# EasyEDA Pro project ProPrj_Zephyr_2026-01-05.epro, schematic Schematic1_3
Board Name: Board1; Create Date: 2025-12-29; Page Name: P1; Project Name: Zephyr; Schematic Name: Schematic1; Update Date: 2025-12-29; Company: EasyEDA.com; Page Size: A4; Version: V1.0
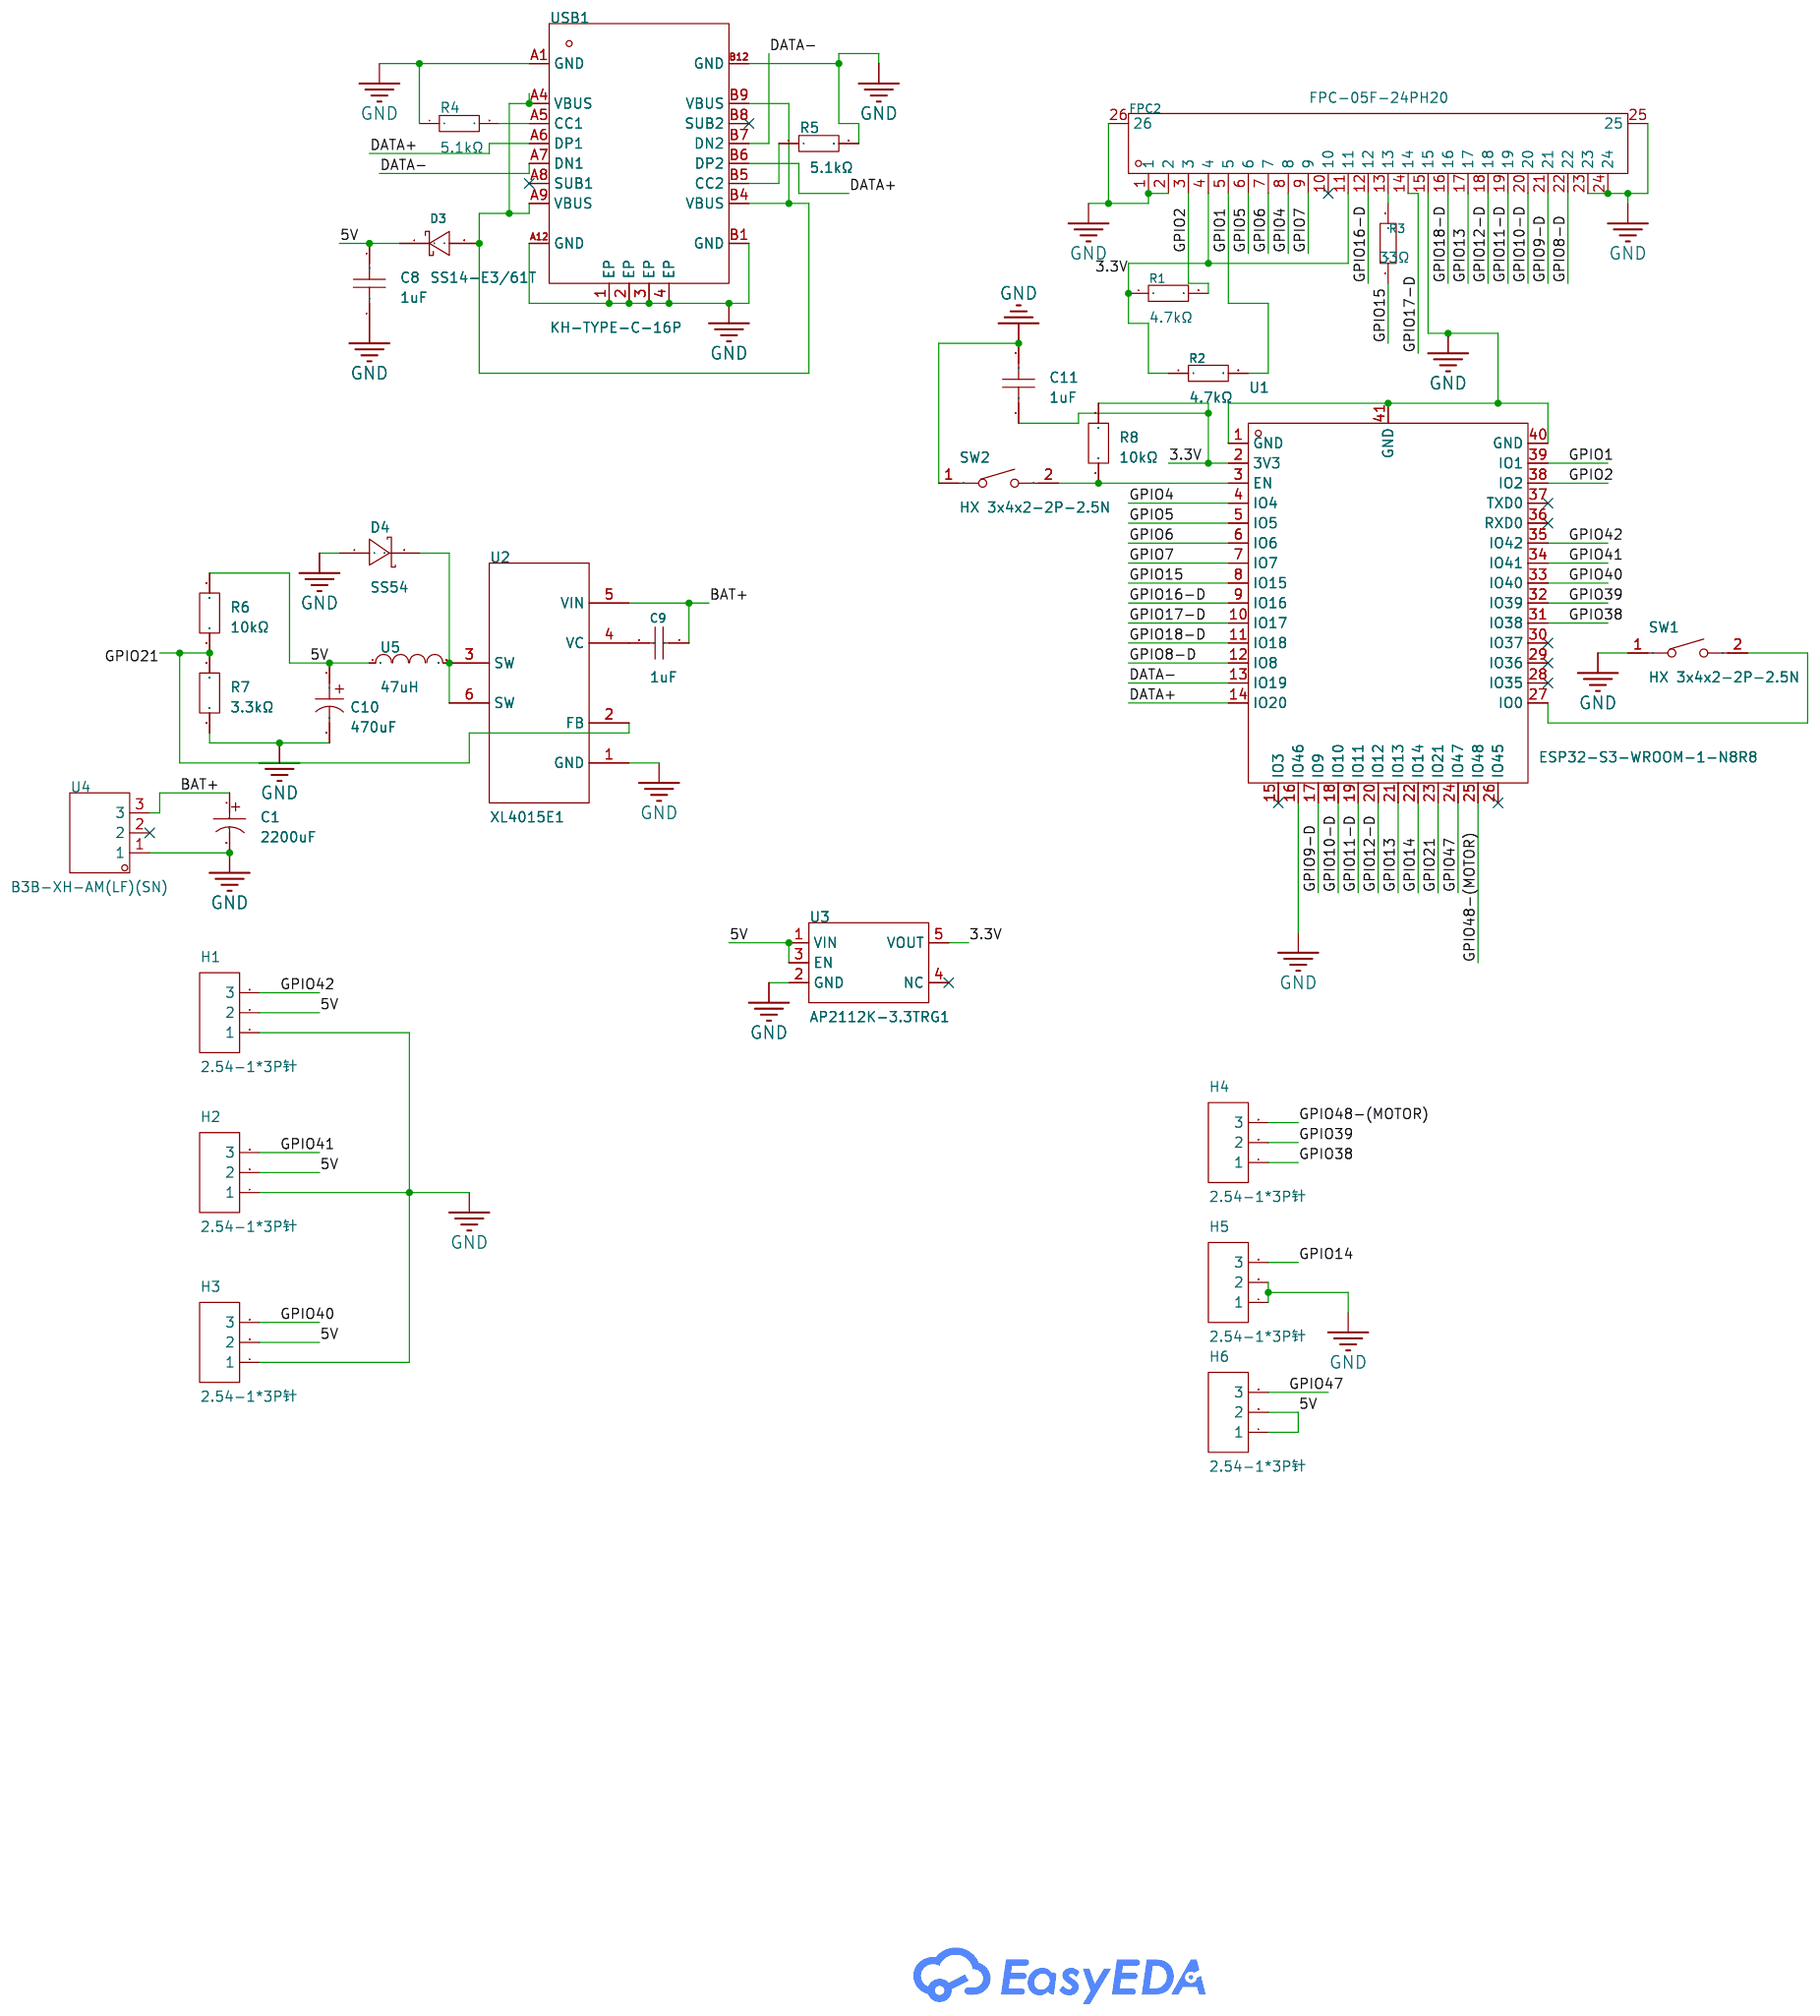
[diagram p2: schematic sheet]

## Parts
C1  2200uF  [CAP-TH_BD13.0-P5.00-D1.2-FD]
C8  1uF  [C1206]
C9  1uF  [C0805]
C10  470uF  [CAP-SMD_BD6.3-L6.6-W6.6-LS7.6-RD]
C11  1uF  [C1206]
D3  SS14-E3/61T  [SMA_L4.3-W2.6-LS5.2-RD]
D4  SS54  [SMA_L4.4-W2.8-LS5.4-R-RD]
FPC2  FPC-05F-24PH20  [FPC-SMD_24P-P0.50_FPC-05F-24PH20]
H1  2.54-1*3P针  [HDR-TH_3P-P2.54-V-M-1]
H2  2.54-1*3P针  [HDR-TH_3P-P2.54-V-M-1]
H3  2.54-1*3P针  [HDR-TH_3P-P2.54-V-M-1]
H4  2.54-1*3P针  [HDR-TH_3P-P2.54-V-M-1]
H5  2.54-1*3P针  [HDR-TH_3P-P2.54-V-M-1]
H6  2.54-1*3P针  [HDR-TH_3P-P2.54-V-M-1]
R1  4.7kΩ  [R1206]
R2  4.7kΩ  [R1206]
R3  33Ω  [R1206]
R4  5.1kΩ  [R1206]
R5  5.1kΩ  [R1206]
R6  10kΩ  [R1206]
R7  3.3kΩ  [R1206]
R8  10kΩ  [R1206]
SW1  HX 3x4x2-2P-2.5N  [SW-SMD_L4.0-W2.9-LS5.0]
SW2  HX 3x4x2-2P-2.5N  [SW-SMD_L4.0-W2.9-LS5.0]
U1  ESP32-S3-WROOM-1-N8R8  [WIRELM-SMD_ESP32-S3-WROOM-1]
U2  XL4015E1  [TO-263-5_L10.2-W8.9-P1.70-TL]
U3  AP2112K-3.3TRG1  [SOT-23-5_L2.9-W1.6-P0.95-LS2.8-BR]
U4  B3B-XH-AM(LF)(SN)  [CONN-TH_3P-P2.50_B3B-XH-AM-LF-SN]
U5  47uH  [IND-SMD_L17.5-W17.2]
USB1  KH-TYPE-C-16P  [USB-C-SMD_KH-TYPE-C-16P]

## Library data of the parts
C1 = KM228M025J20RR0VH2FP0: Capacitance:2200uF Tolerance:±20% Tolerance:±20% Voltage Rating:25V Ripple Current:- Equivalent Series Resistance(ESR):- Pin Spacing:5mm Diameter:13mm Height - Seated (Max):20mm Lifetime:2000hrs@105℃; LCSC Part Name: 2200uF ±20% 25V; Supplier Part: C44598; Manufacturer: Chengx(承兴); Supplier Footprint: 插件,D13xL20mm; JLCPCB Part Class: Extended Part; Datasheet: https://item.szlcsc.com/datasheet/KM228M025J20RR0VH2FP0/45600.html; Supplier: LCSC; Tolerance: ±20%; Voltage Rating: 25V; Pin Spacing: 5mm; Diameter: 13mm; Height - Seated (Max): 20mm; Lifetime: 2000hrs@105℃
C8 C11 = CL31B105KBHNNNE: Capacitance:1uF Tolerance:±10% Tolerance:±10% Voltage Rating:50V Temperature Coefficient:X7R; LCSC Part Name: 1uF ±10% 50V; Supplier Part: C1848; Manufacturer: SAMSUNG(三星); Supplier Footprint: 1206; JLCPCB Part Class: Basic Part; Datasheet: https://item.szlcsc.com/datasheet/CL31B105KBHNNNE/2200.html; Supplier: LCSC; Tolerance: ±10%; Voltage Rating: 50V; Temperature Coefficient: X7R
C9 = CL21B105KBFNNNE: Capacitance:1uF Tolerance:±10% Tolerance:±10% Voltage Rating:50V Temperature Coefficient:X7R; LCSC Part Name: 1uF ±10% 50V; Supplier Part: C28323; Manufacturer: SAMSUNG(三星); Supplier Footprint: 0805; JLCPCB Part Class: Basic Part; Datasheet: https://item.szlcsc.com/datasheet/CL21B105KBFNNNE/29074.html; Supplier: LCSC; Tolerance: ±10%; Voltage Rating: 50V; Temperature Coefficient: X7R
C10 = RVT1C471M0607: Capacitance:470uF Tolerance:±20% Tolerance:±20% Voltage Rating:16V Ripple Current:185mA@120Hz Diameter:6.3mm Height - Seated (Max):7.7mm Lifetime:2000hrs@105℃ Operating Temperature:-40℃~+105℃ Operating Temperature:-40℃~+105℃; LCSC Part Name: 470uF ±20% 16V; Supplier Part: C2977552; Manufacturer: ROQANG(容强); Supplier Footprint: SMD,D6.3xL7.7mm; JLCPCB Part Class: Extended Part; Supplier: LCSC; Tolerance: ±20%; Voltage Rating: 16V; Ripple Current: 185mA@120Hz; Diameter: 6.3mm; Height - Seated (Max): 7.7mm; Lifetime: 2000hrs@105℃; Operating Temperature: -40℃~+105℃
D3 = SS14-E3/61T: Diode Configuration:1 Independent Voltage - Forward(Vf@If):500mV@1A Voltage - DC Reverse(Vr):40V Current - Rectified:1A Reverse Leakage Current (Ir):200uA@40V Operating Junction Temperature Range:-65℃~+150℃ Operating Junction Temperature Range:-65℃~+150℃; LCSC Part Name: 电压:40V 电流:1A; Supplier Part: C47460; Manufacturer: VISHAY(威世); Supplier Footprint: SMA(DO-214AC); JLCPCB Part Class: Extended Part; Datasheet: https://item.szlcsc.com/datasheet/SS14-E3%252F61T/48465.html; Supplier: LCSC; Diode Configuration: 1 Independent; Voltage - Forward(Vf@If): 500mV@1A; Voltage - DC Reverse(Vr): 40V; Current - Rectified: 1A; Reverse Leakage Current (Ir): 200uA@40V; Operating Junction Temperature Range: -65℃~+150℃; Non-Repetitive Peak Forward Surge Current: 40A
D4 = SS54_C22452: Diode Configuration:Independent Voltage - Forward(Vf@If):550mV@5A Voltage - DC Reverse(Vr):40V Current - Rectified:5A Reverse Leakage Current (Ir):1mA@40V Operating Junction Temperature Range:-55℃~+125℃ Operating Junction Temperature Range:-55℃~+125℃; LCSC Part Name: 电压:40V 电流:5A; Supplier Part: C22452; Manufacturer: MDD(辰达半导体); Supplier Footprint: SMA(DO-214AC); JLCPCB Part Class: Basic Part; Datasheet: https://item.szlcsc.com/datasheet/SS54/23178.html; Supplier: LCSC; Diode Configuration: Independent; Voltage - Forward(Vf@If): 550mV@5A; Voltage - DC Reverse(Vr): 40V; Current - Rectified: 5A; Reverse Leakage Current (Ir): 1mA@40V; Operating Junction Temperature Range: -55℃~+125℃
FPC2 = FPC-05F-24PH20: Locking Feature:Hinged Lid Contact Type:Surface Mount Number of Contacts:24P Pitch:0.5mm Mounting Type:Bottom Contact FFC, FCB Thickness:0.3mm FFC, FCB Thickness:0.3mm Height Above Board:2mm Contact Material:Phosphor Bronze Contact Plating:Tin Operating T; LCSC Part Name: 翻盖式 卧贴 P数:24P 间距:0.5mm; Supplier Part: C2856805; Manufacturer: XUNPU(讯普); Supplier Footprint: SMD,P=0.5mm,卧贴; JLCPCB Part Class: Extended Part; Datasheet: https://item.szlcsc.com/datasheet/FPC-05F-24PH20/3056903.html; Supplier: LCSC; Locking Feature: Hinged Lid; Contact Type: Surface Mount; Number of Contacts: 24P; Pitch: 0.5mm; Mounting Type: Bottom Contact; FFC, FCB Thickness: 0.3mm; Height Above Board: 2mm; Contact Material: Phosphor Bronze; Contact Plating: Tin; Operating Temperature: -25℃~+85℃; Rated Voltage (Max): 50V; Current Rating (Max): 500mA
H1-H6 = 2.54-1*3P针: Pin Structure:1x3P Pitch:2.54mm Row Spacing:- Circluar Pins/Square Pins:Pin Header Mounting Type:Through Hole Number of Rows:1 Number of Pins:3P Current Rating:3A Voltage Rating (Max):- Length of Mating Pin:6mm Insulation Height:2.5mm Length of End Connec; LCSC Part Name: 1x3P 间距:2.54mm 方针 直插; Supplier Part: C49257; Manufacturer: BOOMELE(博穆精密); Supplier Footprint: 插件,P=2.54mm; JLCPCB Part Class: Extended Part; Datasheet: https://item.szlcsc.com/datasheet/2.54-1*3P%25E9%2592%2588/50265.html; Supplier: LCSC; Pin Structure: 1x3P; Pitch: 2.54mm; Circluar Pins/Square Pins: Pin Header; Mounting Type: Through Hole; Number of Rows: 1; Number of Pins: 3P; Current Rating: 3A; Length of Mating Pin: 6mm; Insulation Height: 2.5mm; Length of End Connection Pin: 3mm; Contact Material: Brass; Contact Plating: Gold; Operating Temperature: -40℃~+105℃; Color: Black
R1 R2 = 1206W4F4701T5E: Type:Thick Film Resistor Resistance:4.7kΩ Tolerance:±1% Tolerance:±1% Power(Watts):250mW Voltage-Supply(Max):200V Temperature Coefficient:±100ppm/℃ Temperature Coefficient:±100ppm/℃ Operating Temperature:-55℃~+155℃ Operating Temperature:-55℃~+155℃; LCSC Part Name: 4.7kΩ ±1% 250mW 厚膜电阻; Supplier Part: C17936; Manufacturer: UNI-ROYAL(厚声); Supplier Footprint: 1206; JLCPCB Part Class: Basic Part; Datasheet: https://item.szlcsc.com/datasheet/1206W4F4701T5E/18624.html; Supplier: LCSC; Type: Thick Film Resistor; Tolerance: ±1%; Power(Watts): 250mW; Voltage-Supply(Max): 200V; Temperature Coefficient: ±100ppm/℃; Operating Temperature: -55℃~+155℃
R3 = 1206W4F330JT5E: Type:Thick Film Resistor Resistance:33Ω Tolerance:±1% Tolerance:±1% Power(Watts):250mW Voltage-Supply(Max):200V Temperature Coefficient:±200ppm/℃ Temperature Coefficient:±200ppm/℃ Operating Temperature:-55℃~+155℃ Operating Temperature:-55℃~+155℃; LCSC Part Name: 33Ω ±1% 250mW 厚膜电阻; Supplier Part: C18005; Manufacturer: UNI-ROYAL(厚声); Supplier Footprint: 1206; JLCPCB Part Class: Extended Part; Datasheet: https://item.szlcsc.com/datasheet/1206W4F330JT5E/18693.html; Supplier: LCSC; Type: Thick Film Resistor; Tolerance: ±1%; Power(Watts): 250mW; Voltage-Supply(Max): 200V; Temperature Coefficient: ±200ppm/℃; Operating Temperature: -55℃~+155℃
R4 R5 = RC1206FR-075K1L: Type:Thick Film Resistor Resistance:5.1kΩ Tolerance:±1% Tolerance:±1% Power(Watts):250mW Voltage-Supply(Max):200V Temperature Coefficient:±100ppm/℃ Temperature Coefficient:±100ppm/℃ Operating Temperature:-55℃~+155℃ Operating Temperature:-55℃~+155℃; LCSC Part Name: 厚膜电阻 5.1kΩ ±1% 250mW; Supplier Part: C163372; Manufacturer: YAGEO(国巨); Supplier Footprint: 1206; JLCPCB Part Class: Extended Part; Datasheet: https://item.szlcsc.com/datasheet/RC1206FR-075K1L/174753.html; Supplier: LCSC; Type: Thick Film Resistor; Tolerance: ±1%; Power(Watts): 250mW; Voltage-Supply(Max): 200V; Temperature Coefficient: ±100ppm/℃; Operating Temperature: -55℃~+155℃
R6 R8 = FRC1206J103 TS: Type:Thick Film Resistor Resistance:10kΩ Tolerance:±5% Tolerance:±5% Power(Watts):250mW Voltage-Supply(Max):200V Temperature Coefficient:±100ppm/℃ Temperature Coefficient:±100ppm/℃ Operating Temperature:-55℃~+155℃ Operating Temperature:-55℃~+155℃; LCSC Part Name: 10kΩ ±5% 250mW 厚膜电阻; Supplier Part: C2907423; Manufacturer: FOJAN(富捷); Supplier Footprint: 1206; JLCPCB Part Class: Extended Part; Supplier: LCSC; Type: Thick Film Resistor; Tolerance: ±5%; Power(Watts): 250mW; Voltage-Supply(Max): 200V; Temperature Coefficient: ±100ppm/℃; Operating Temperature: -55℃~+155℃
R7 = FRC1206J332 TS: Type:Thick Film Resistor Resistance:3.3kΩ Tolerance:±5% Tolerance:±5% Power(Watts):250mW Voltage-Supply(Max):200V Temperature Coefficient:±100ppm/℃ Temperature Coefficient:±100ppm/℃ Operating Temperature:-55℃~+155℃ Operating Temperature:-55℃~+155℃; LCSC Part Name: 3.3kΩ ±5% 250mW 厚膜电阻; Supplier Part: C2907469; Manufacturer: FOJAN(富捷); Supplier Footprint: 1206; JLCPCB Part Class: Extended Part; Supplier: LCSC; Type: Thick Film Resistor; Tolerance: ±5%; Power(Watts): 250mW; Voltage-Supply(Max): 200V; Temperature Coefficient: ±100ppm/℃; Operating Temperature: -55℃~+155℃
SW1 SW2 = HX 3x4x2-2P-2.5N: Circuit:SPST Actuator Style:Round Button Operating Force:2.5N Mounting Type:Surface Mount,Vertical Length:4mm Width:3mm Switch Height:2mm with Bracket:Without Bracket Contact Current:50mA Voltage Rating:12V Actuator/Cap Color:Black With Lamp:No IP Rating:; LCSC Part Name: 4*3*2mm 立贴 轻触开关; Supplier Part: C36498961; Manufacturer: hanxia(韩下); Supplier Footprint: SMD,3x4mm; JLCPCB Part Class: Extended Part; Datasheet: https://item.szlcsc.com/datasheet/HX%25203x4x2-2P-2.5N/38220903.html; Supplier: LCSC; Circuit: SPST; Actuator Style: Round Button; Operating Force: 2.5N; Mounting Type: Surface Mount,Vertical; Length: 4mm; Width: 3mm; Switch Height: 2mm; with Bracket: Without Bracket; Contact Current: 50mA; Voltage Rating: 12V; Actuator/Cap Color: Black; With Lamp: No; Termination Style: SMD(SMT) Tab; Life: 100,000 Cycles
U1 = ESP32-S3-WROOM-1-N8R8: Supplier Part: C2913201; Manufacturer: ESPRESSIF(乐鑫); Supplier Footprint: SMD,25.5x18mm; JLCPCB Part Class: Extended Part; Datasheet: https://item.szlcsc.com/datasheet/ESP32-S3-WROOM-1-N8R8/3198299.html; Supplier: LCSC
U2 = XL4015E1: Function:Buck Voltage - Supply:8V~36V Voltage - Supply:8V~36V Output Voltage:1.25V~32V Output Voltage:1.25V~32V Output Current:5A Frequency - Switching:180kHz Frequency - Switching:180kHz Operating Temperature:-40℃~+125℃ Operating Temperature:-40℃~+125℃ S; LCSC Part Name: 5A 180KHz 36V 降压型DC-DC转换器; Supplier Part: C51661; Manufacturer: XLSEMI(芯龙); Supplier Footprint: TO-263-5; JLCPCB Part Class: Extended Part; Datasheet: https://item.szlcsc.com/datasheet/XL4015E1/52674.html; Supplier: LCSC; Function: Buck; Voltage - Supply: 8V~36V; Output Voltage: 1.25V~32V; Output Current: 5A; Frequency - Switching: 180kHz; Operating Temperature: -40℃~+125℃; Synchronous Rectifier: No; Number of Outputs: 1; Topology: Buck; Quiescent Current: 5mA; Switch tube (built-in/external): Built-in; Output Type: Adjustable
U3 = AP2112K-3.3TRG1_C23380830: Output Type:Fixed Voltage - Supply:5.5V Output Voltage:3.3V Output Voltage:3.3V Output Current:600mA Power Supply Rejection Ratio (PSRR):75dB@(1kHz) Voltage Dropout:320mV@(600mA) standby current:10uA Features:Over Temperature Protection Operating Temperat; LCSC Part Name: 集成电路; Supplier Part: C23380830; Manufacturer: TECH PUBLIC(台舟); Supplier Footprint: SOT-23-5; JLCPCB Part Class: Extended Part; Datasheet: https://item.szlcsc.com/datasheet/AP2112K-3.3TRG1/25111500.html; Supplier: LCSC; Output Type: Fixed; Voltage - Supply: 5.5V; Output Voltage: 3.3V; Output Current: 600mA; Power Supply Rejection Ratio (PSRR): 75dB@(1kHz); Voltage Dropout: 320mV@(600mA); standby current: 10uA; Features: Over Temperature Protection; Operating Temperature: -40℃~+85℃@(Ta); Output Configuration: Positive; Number of Outputs: 1
U4 = B3B-XH-AM(LF)(SN): Pins Structure:1x3P Pitch:2.5mm Mounting Type:Through Hole Reference Series:XH Number of Pins:3P Number of Rows:1 Number of PINs Per Row:3 Row Spacing:- Current Rating:3A Contact Material:Brass Contact Plating:Tin Operating Temperature:-25℃~+85℃ Operating; LCSC Part Name: 1x3P 间距:2.5mm 直插 系列:XH; Supplier Part: C161870; Manufacturer: JST; Supplier Footprint: 插件,P=2.5mm; JLCPCB Part Class: Extended Part; Datasheet: https://item.szlcsc.com/datasheet/B3B-XH-AM(LF)(SN)/173251.html; Supplier: LCSC; Pins Structure: 1x3P; Pitch: 2.5mm; Mounting Type: Through Hole; Reference Series: XH; Number of Pins: 3P; Number of Rows: 1; Number of PINs Per Row: 3; Current Rating: 3A; Contact Material: Brass; Contact Plating: Tin; Operating Temperature: -25℃~+85℃; Voltage Rating: 250V; Plastic Material: PA66; Flame Retardant Rating: UL94V-0; Supplementary Features: with locating pin；K Pin; Color: White; Z-Height of the Board: 7mm; X-Length of Bottom Edge on Board (Spacing Line): 9.9mm; Y-Width of Bottom Edge on Board: 5.75mm
U5 = SMMS1770-470M: Inductance: Tolerance:±20% Tolerance:±20% Rated Current: Saturation Current (Isat):16A DC Resistance (DCR): Type:一体成型电感 Ratings:-; LCSC Part Name: 47uH ±20% 16A; Supplier Part: C2976971; Manufacturer: SXN(顺翔诺); Supplier Footprint: SMD,17.5x17.15x7mm; JLCPCB Part Class: Extended Part; Datasheet: https://atta.szlcsc.com/upload/public/pdf/source/20220224/D8C8E12B51A4AD75CA32F676574334C0.pdf; Supplier: LCSC; Tolerance: ±20%; Saturation Current (Isat): 16A; Type: 一体成型电感
USB1 = KH-TYPE-C-16P: Connector Type:Type-C Standard:- Gender:Female Number of Ports:1 Number of Contacts:16P Mounting Style:卧贴 Current Rating - Power (Max):3A Operating Temperature Range:-40℃~+85℃ Operating Temperature Range:-40℃~+85℃; LCSC Part Name: Type-C 母 卧贴; Supplier Part: C709357; Manufacturer: kinghelm(金航标); Supplier Footprint: SMD; JLCPCB Part Class: Extended Part; Datasheet: https://atta.szlcsc.com/upload/public/pdf/source/20200911/C709357_AA8DCEB38BB20E3035A7ED7AE7667837.pdf; Supplier: LCSC; Connector Type: Type-C; Gender: Female; Number of Ports: 1; Number of Contacts: 16P; Mounting Style: 卧贴; Current Rating - Power (Max): 3A; Operating Temperature Range: -40℃~+85℃

## Nets
3.3V: C11.1 FPC2.4 FPC2.11 R1.1 R2.1 R8.2 U1.2(3V3) U3.5(VOUT)
5V: C8.2 C10.1 D3.1(K) H1.2 H2.2 H3.2 H6.1 H6.2 R6.2 U3.1(VIN) U3.3(EN) U5.1
GND: C1.2 C8.1 C10.2 C11.2 D4.1(A) FPC2.1 FPC2.2 FPC2.15 FPC2.23 FPC2.24 FPC2.25 FPC2.26 H1.1 H2.1 H3.1 H5.1 H5.2 R4.1 R5.2 R7.1 SW1.1 SW2.1 U1.1(GND) U1.16(IO46) U1.40(GND) U1.41(GND) U2.1(GND) U3.2(GND) U4.1 USB1.1(EP) USB1.2(EP) USB1.3(EP) USB1.4(EP) USB1.A1(GND) USB1.A12(GND) USB1.B1(GND) USB1.B12(GND)
BAT+: C1.1 C9.2 U2.5(VIN) U4.3
DATA+: U1.14(IO20) USB1.A6(DP1) USB1.B6(DP2)
DATA-: U1.13(IO19) USB1.A7(DN1) USB1.B7(DN2)
GPIO1: FPC2.5 R2.2 U1.39(IO1)
GPIO2: FPC2.3 R1.2 U1.38(IO2)
GPIO4: FPC2.8 U1.4(IO4)
GPIO5: FPC2.6 U1.5(IO5)
GPIO6: FPC2.7 U1.6(IO6)
GPIO7: FPC2.9 U1.7(IO7)
GPIO8-D: FPC2.22 U1.12(IO8)
GPIO9-D: FPC2.21 U1.17(IO9)
GPIO10-D: FPC2.20 U1.18(IO10)
GPIO11-D: FPC2.19 U1.19(IO11)
GPIO12-D: FPC2.18 U1.20(IO12)
GPIO13: FPC2.17 U1.21(IO13)
GPIO14: H5.3 U1.22(IO14)
GPIO15: R3.1 U1.8(IO15)
GPIO16-D: FPC2.12 U1.9(IO16)
GPIO17-D: FPC2.14 U1.10(IO17)
GPIO18-D: FPC2.16 U1.11(IO18)
GPIO21: R6.1 R7.2 U1.23(IO21) U2.2(FB)
GPIO38: H4.1 U1.31(IO38)
GPIO39: H4.2 U1.32(IO39)
GPIO40: H3.3 U1.33(IO40)
GPIO41: H2.3 U1.34(IO41)
GPIO42: H1.3 U1.35(IO42)
GPIO47: H6.3 U1.24(IO47)
GPIO48-(MOTOR): H4.3 U1.25(IO48)
Net-(C9-1): C9.1 U2.4(VC)
Net-(D3-2): D3.2(A) USB1.A4(VBUS) USB1.A9(VBUS) USB1.B4(VBUS) USB1.B9(VBUS)
Net-(D4-2): D4.2(K) U2.3(SW) U2.6(SW) U5.2
Net-(FPC2-13): FPC2.13 R3.2
Net-(R4-2): R4.2 USB1.A5(CC1)
Net-(R5-1): R5.1 USB1.B5(CC2)
Net-(R8-1): R8.1 SW2.2 U1.3(EN)
Net-(SW1-2): SW1.2 U1.27(IO0)

Not connected (* = marked no-connect by the designer): FPC2 10*; U1 15(IO3)* 26(IO45)* 28(IO35)* 29(IO36)* 30(IO37)* 36(RXD0)* 37(TXD0)*; U3 4(NC)*; U4 2*; USB1 A8(SUB1)* B8(SUB2)*
